# Altium schematic sheet FPGA_Video_Windows.SchDoc: LiveDesign Evaluation - Video Windows
size A4; Organization: Altium Limited; Address1: L3, 12a Rodborough Rd; Address2: Frenchs Forest; Address3: NSW; Address4: Australia 2086; DocumentNumber: 1; SheetNumber: 1; SheetTotal: 20
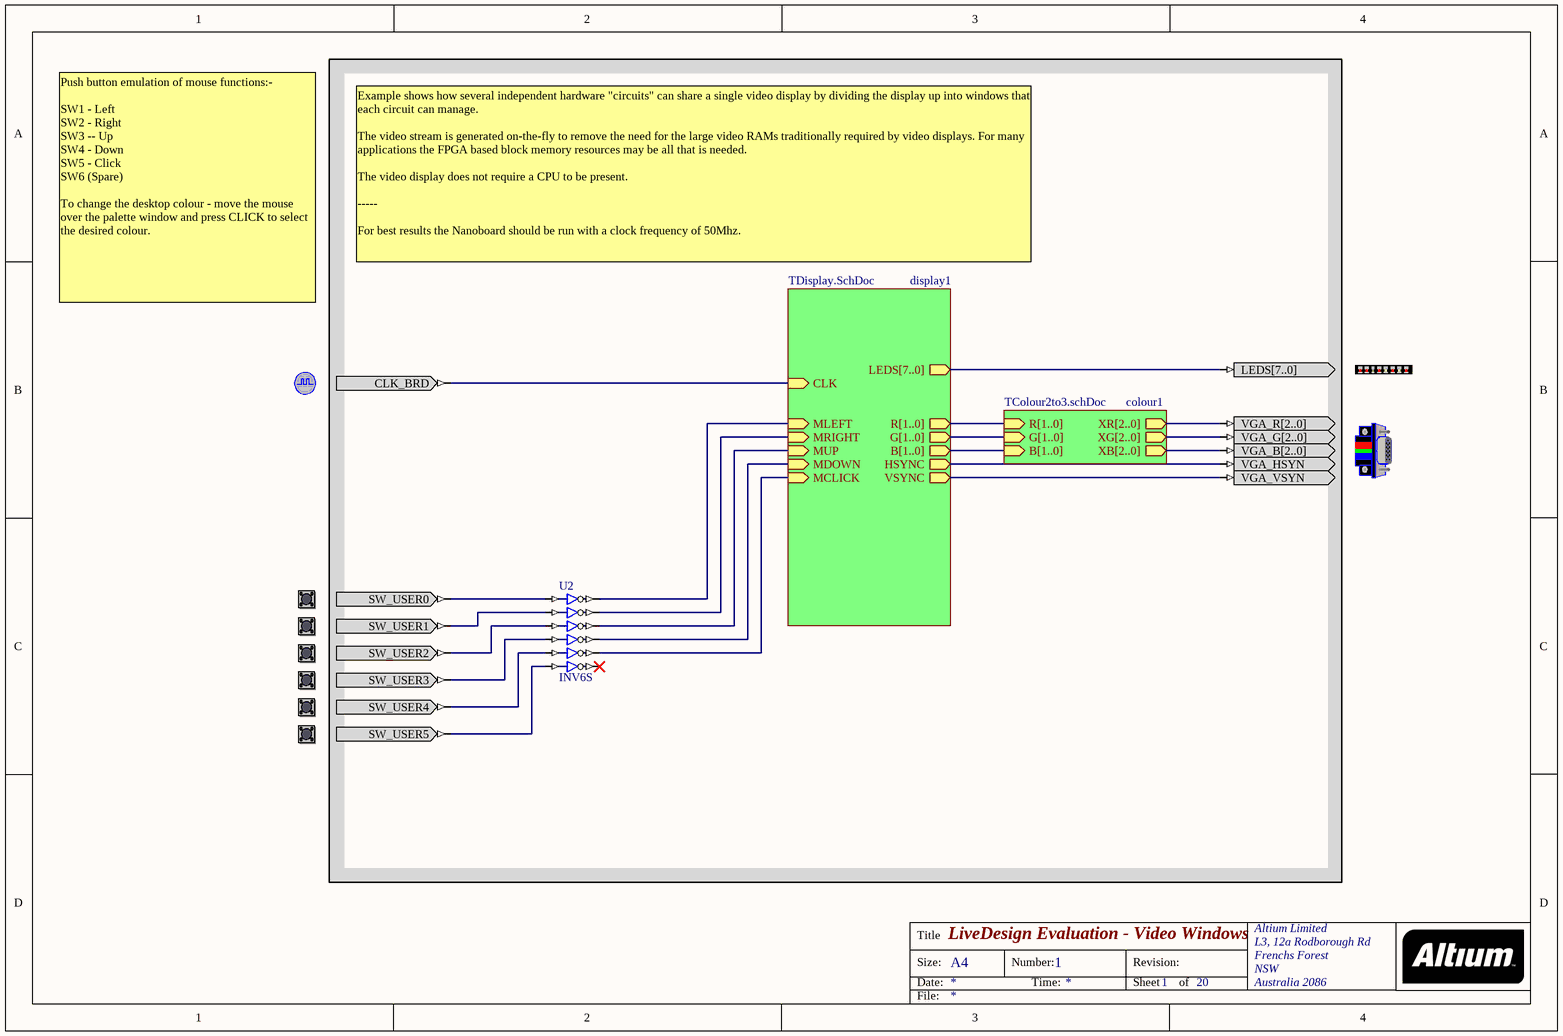
[diagram p0: FPGA_Video_Windows.SchDoc]

## Parts
CLOCK_BOARD  CLOCK_BOARD  (value not drawn)
LED  LED  (value not drawn)
U2  INV6S
USER_BUTTONX6  USER_BUTTONX6  (value not drawn)
VGACNTR  VGACNTR  (value not drawn)

## Sub-sheets
colour1 = TColour2to3.schDoc: XR[2..0] (out), XG[2..0] (out), XB[2..0] (out), R[1..0] (in), G[1..0] (in), B[1..0] (in)
display1 = TDisplay.SchDoc: CLK (in), HSYNC (out), VSYNC (out), R[1..0] (out), G[1..0] (out), B[1..0] (out), MLEFT (in), MRIGHT (in), LEDS[7..0] (out), MUP (in), MDOWN (in), MCLICK (in)

## Nets
NetCLOCK_BOARD_CLK_BRD: CLOCK_BOARD.CLK_BRD ; sheet display1/CLK
NetLED_LEDS[7..0]: LED.LEDS[7..0] ; sheet display1/LEDS[7..0]
NetU2_I0: U2.I0 USER_BUTTONX6.SW_USER0
NetU2_I1: U2.I1 USER_BUTTONX6.SW_USER1
NetU2_I2: U2.I2 USER_BUTTONX6.SW_USER2
NetU2_I3: U2.I3 USER_BUTTONX6.SW_USER3
NetU2_I4: U2.I4 USER_BUTTONX6.SW_USER4
NetU2_I5: U2.I5 USER_BUTTONX6.SW_USER5
NetU2_O0: U2.O0 ; sheet display1/MLEFT
NetU2_O1: U2.O1 ; sheet display1/MRIGHT
NetU2_O2: U2.O2 ; sheet display1/MUP
NetU2_O3: U2.O3 ; sheet display1/MDOWN
NetU2_O4: U2.O4 ; sheet display1/MCLICK
NetVGACNTR_VGA_B[2..0]: VGACNTR.VGA_B[2..0] ; sheet colour1/XB[2..0]
NetVGACNTR_VGA_G[2..0]: VGACNTR.VGA_G[2..0] ; sheet colour1/XG[2..0]
NetVGACNTR_VGA_HSYN: VGACNTR.VGA_HSYN ; sheet display1/HSYNC
NetVGACNTR_VGA_R[2..0]: VGACNTR.VGA_R[2..0] ; sheet colour1/XR[2..0]
NetVGACNTR_VGA_VSYN: VGACNTR.VGA_VSYN ; sheet display1/VSYNC

Not connected (* = marked no-connect by the designer): U2 O5*

## Buses and harness runs
bus sheet colour1/B[1..0] = sheet display1/B[1..0]
bus sheet colour1/G[1..0] = sheet display1/G[1..0]
bus sheet colour1/R[1..0] = sheet display1/R[1..0]

## Notes on the sheet
- Push button emulation of mouse functions:-
  SW1 - Left
  SW2 - Right
  SW3 -- Up
  SW4 - Down
  SW5 - Click
  SW6 (Spare)
  To change the desktop colour - move the mouse over the palette window and press CLICK to select the desired colour.
- Example shows how several independent hardware "circuits" can share a single video display by dividing the display up into windows that each circuit can manage.
  The video stream is generated on-the-fly to remove the need for the large video RAMs traditionally required by video displays. For many applications the FPGA based block memory resources may be all that is needed.
  The video display does not require a CPU to be present.
  -----
  For best results the Nanoboard should be run with a clock frequency of 50Mhz.
- Title
- Size:
- Date:
- A4
- Number:
- Time:
- Revision:
- Sheet
- of
- File:

## Library data of the parts
CLOCK_BOARD = CLOCK_BOARD: Global System Clock Supply; PortComponent: True; Published: 19-Nov-2003; Publisher: Altium Limited
LED = LED: 8-Way LEDS; PortComponent: True; Published: 19-Nov-2003; Publisher: Altium Limited
U2 = INV6S: 6-Bit Inverter, Single Pin Version; Functional Class: Logic Primitive; Sub Class: INV; Port Size: 6; ArchiveName: GENERIC; VHDLIB_SIM: GENERIC_LIB; Published: 29-Jan-2004; Publisher: Altium Limited; Core Revision: 1.00.00; HelpURL: CR0118 FPGA Generic Library Guide.pdf#page=290; Port Style: Single Pin Version
USER_BUTTONX6 = USER_BUTTONX6: User Buttons; PortComponent: True; Published: 19-Nov-2003; Publisher: Altium Limited
VGACNTR = VGACNTR: VGA Dsub-15-Female-HD; PortComponent: True; Published: 19-Nov-2003; Publisher: Altium Limited